# Altium project eBox_main.PrjPcb (part 2 of 2)

## Sheet eBox_ACdetect2.SchDoc: eBox_AC_Detect (2)
size A4; DocumentNumber: 7; SheetNumber: 7; SheetTotal: 9
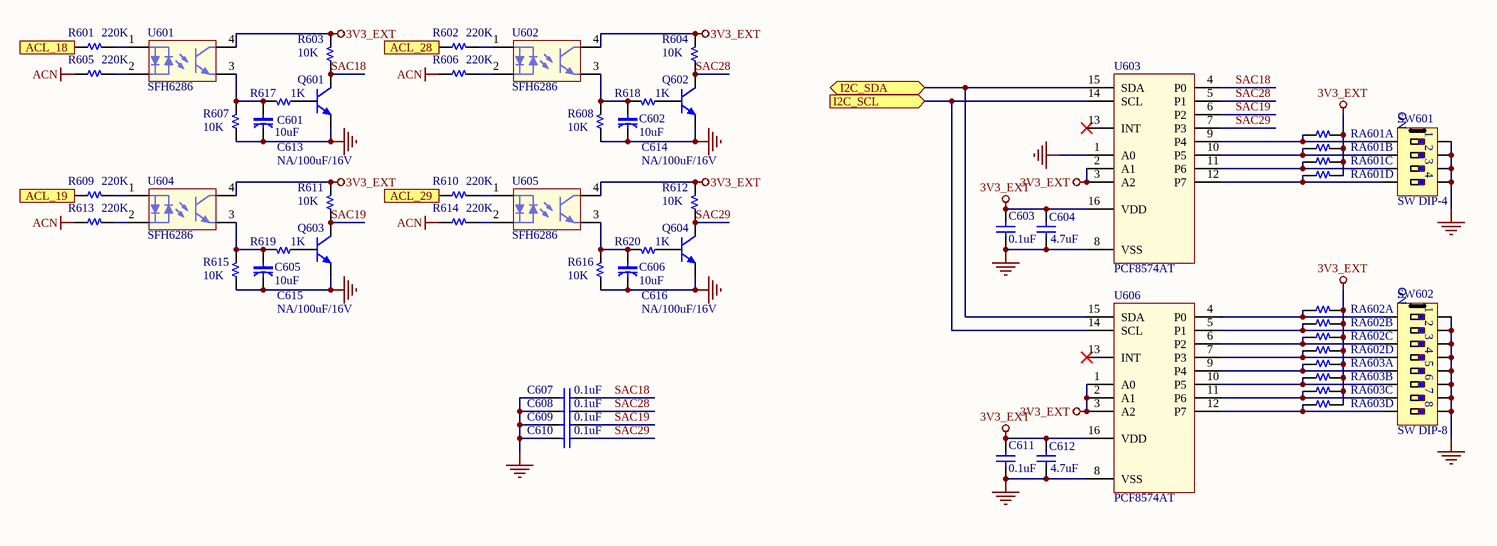
[diagram p6: eBox_ACdetect2.SchDoc]

### Parts
C601  10uF  [C 0805]
C602  10uF  [C 0805]
C603  0.1uF  [C 0603]
C604  4.7uF  [C 0603]
C605  10uF  [C 0805]
C606  10uF  [C 0805]
C607  0.1uF  [C 0805]
C608  0.1uF  [C 0805]
C609  0.1uF  [C 0805]
C610  0.1uF  [C 0805]
C611  0.1uF  [C 0603]
C612  4.7uF  [C 0603]
C613  NA/100uF/16V  [CYL/D.200/LS.75-D50H70P20]
C614  NA/100uF/16V  [CYL/D.200/LS.75-D50H70P20]
C615  NA/100uF/16V  [CYL/D.200/LS.75-D50H70P20]
C616  NA/100uF/16V  [CYL/D.200/LS.75-D50H70P20]
Q601  MMBT3904LT1G  [SOT-23]  (value not drawn)
Q602  MMBT3904LT1G  [SOT-23]  (value not drawn)
Q603  MMBT3904LT1G  [SOT-23]  (value not drawn)
Q604  MMBT3904LT1G  [SOT-23]  (value not drawn)
R601  220K  [R 0805]
R602  220K  [R 0805]
R603  10K  [R 0805]
R604  10K  [R 0805]
R605  220K  [R 0805]
R606  220K  [R 0805]
R607  10K  [R 0805]
R608  10K  [R 0805]
R609  220K  [R 0805]
R610  220K  [R 0805]
R611  10K  [R 0805]
R612  10K  [R 0805]
R613  220K  [R 0805]
R614  220K  [R 0805]
R615  10K  [R 0805]
R616  10K  [R 0805]
R617  1K  [R 0805]
R618  1K  [R 0805]
R619  1K  [R 0805]
R620  1K  [R 0805]
RA601  10K  [RAx4 1206 (3216)]  (value not drawn)  (parts A,B,C,D of 4)
RA602  10K  [RAx4 1206 (3216)]  (value not drawn)  (parts A,B,C,D of 4)
RA603  10K  [RAx4 1206 (3216)]  (value not drawn)  (parts A,B,C,D of 4)
SW601  SW DIP-4  [SW/DIP4]
SW602  SW DIP-8  [SW/DIP8/300]
U601  SFH6286  [SOP4 - SFH6286]
U602  SFH6286  [SOP4 - SFH6286]
U603  PCF8574AT  [SO16/PCF8574AT]
U604  SFH6286  [SOP4 - SFH6286]
U605  SFH6286  [SOP4 - SFH6286]
U606  PCF8574AT  [SO16/PCF8574AT]

### Ports
ACL_18 (in), ACL_19 (in), ACL_28 (in), ACL_29 (in), I2C_SCL (in), I2C_SDA (bidir)

### Nets
3V3_EXT: C603.1 C604.1 C611.1 C612.1 R603.2 R604.2 R611.2 R612.2 RA601.5 RA601.6 RA601.7 RA601.8 RA602.5 RA602.6 RA602.7 RA602.8 RA603.5 RA603.6 RA603.7 RA603.8 U601.4(C) U602.4(C) U603.2(A1) U603.3(A2) U603.16(VDD) U604.4(C) U605.4(C) U606.1(A0) U606.2(A1) U606.3(A2) U606.16(VDD)
ACN: R605.1 R606.1 R613.1 R614.1
GND: C601.2 C602.2 C603.2 C604.2 C605.2 C606.2 C607.1 C608.1 C609.1 C610.1 C611.2 C612.2 C613.2 C614.2 C615.2 C616.2 Q601.2(E) Q602.2(E) Q603.2(E) Q604.2(E) R607.1 R608.1 R615.1 R616.1 SW601.1 SW601.2 SW601.3 SW601.4 SW602.1 SW602.2 SW602.3 SW602.4 SW602.5 SW602.6 SW602.7 SW602.8 U603.1(A0) U603.8(VSS) U606.8(VSS)
ACL18: R601.1 ; port ACL_18
ACL19: R609.1 ; port ACL_19
ACL28: R602.1 ; port ACL_28
ACL29: R610.1 ; port ACL_29
I2C1_SCL: U603.14(SCL) U606.14(SCL) ; port I2C_SCL
I2C1_SDA: U603.15(SDA) U606.15(SDA) ; port I2C_SDA
SAC18: C607.2 Q601.3(C) R603.1 U603.4(P0)
SAC19: C609.2 Q603.3(C) R611.1 U603.6(P2)
SAC28: C608.2 Q602.3(C) R604.1 U603.5(P1)
SAC29: C610.2 Q604.3(C) R612.1 U603.7(P3)
NetC601_1: C601.1 C613.1 R607.2 R617.2 U601.3(E)
NetC602_1: C602.1 C614.1 R608.2 R618.2 U602.3(E)
NetC605_1: C605.1 C615.1 R615.2 R619.2 U604.3(E)
NetC606_1: C606.1 C616.1 R616.2 R620.2 U605.3(E)
NetQ601_1: Q601.1(B) R617.1
NetQ602_1: Q602.1(B) R618.1
NetQ603_1: Q603.1(B) R619.1
NetQ604_1: Q604.1(B) R620.1
NetR601_2: R601.2 U601.1(A/C)
NetR602_2: R602.2 U602.1(A/C)
NetR605_2: R605.2 U601.2(C/A)
NetR606_2: R606.2 U602.2(C/A)
NetR609_2: R609.2 U604.1(A/C)
NetR610_2: R610.2 U605.1(A/C)
NetR613_2: R613.2 U604.2(C/A)
NetR614_2: R614.2 U605.2(C/A)
NetRA601_1: RA601.1 SW601.8 U603.9(P4)
NetRA601_2: RA601.2 SW601.7 U603.10(P5)
NetRA601_3: RA601.3 SW601.6 U603.11(P6)
NetRA601_4: RA601.4 SW601.5 U603.12(P7)
NetRA602_1: RA602.1 SW602.16 U606.4(P0)
NetRA602_2: RA602.2 SW602.15 U606.5(P1)
NetRA602_3: RA602.3 SW602.14 U606.6(P2)
NetRA602_4: RA602.4 SW602.13 U606.7(P3)
NetRA603_1: RA603.1 SW602.12 U606.9(P4)
NetRA603_2: RA603.2 SW602.11 U606.10(P5)
NetRA603_3: RA603.3 SW602.10 U606.11(P6)
NetRA603_4: RA603.4 SW602.9 U606.12(P7)

Not connected (* = marked no-connect by the designer): U603 13(INT)*; U606 13(INT)*

### Notes on the sheet
- Title
- Size:
- Date:
- A4
- Number:
- Time:
- Revision:
- Sheet
- of
- NPN
- Lab
- File:
- (in symbol SW DIP-4) ON
- (in symbol SW DIP-8) ON

### Library data of the parts
C601 C602 C605-C610 = Capacitor NP: CAP CER 0.1UF 50V X7R 0805; TYPE: SMD; PACKAGE: SMD0805; STOCK CODE: CL21B104KBNC; SUPPLIER: tme.vn; STOCK DESC: 100nF/50V ±10% X7R SMD-0805 Capacitor
  C601 C602 C605 C606: UNIT PRICE: 500
  C607-C610: UNIT PRICE: 400
C603 C611 = Capacitor NP: CAP CER 0.1UF 50V X7R 0603; TYPE: SMD; PACKAGE: SMD0603; STOCK CODE: CC0603KRX7R9BB104; SUPPLIER: tme.vn; STOCK DESC: 100nF/50V ±10% X7R SMD-0603 Capacitor; UNIT PRICE: 400
C604 C612 = Capacitor NP: CAP CER 4.7UF 50V X7R 0603; TYPE: SMD; PACKAGE: SMD0603; STOCK CODE: CC0603KRX5R6BB475; SUPPLIER: tme.vn; STOCK DESC: 4.7uF 10V ±10% X5R SMD-0603 Capacitor; UNIT PRICE: 600
C613-C616 = Capacitor: CAP ALUM 100UF 20% 16V RADIAL; TYPE: NA; PACKAGE: 5x7 mm; STOCK CODE: 100uF/16V; SUPPLIER: tme.vn; STOCK DESC: 100uF/16V ±20% Aluminum Electrolytic Capacitor, 5x7 mm; UNIT PRICE: 800
Q601-Q604 = Transistor NPN: TRANS NPN 40V 0.2A SOT23; TYPE: SMD; STOCK CODE: LMBT3904LT1G; SUPPLIER: tme.vn; STOCK DESC: NPN General-Purpose Amplifier SMD Transistor; UNIT PRICE: 600
R601 R602 R605 R606 R609 R610 R613 R614 = Resistor: RES SMD 220K OHM 1% 1/8W 0805; PACKAGE: SMD0805; STOCK CODE: RM10JTN224; SUPPLIER: tme.vn; TYPE: SMD; STOCK DESC: 220K 5% SMD-0805 Resistor; UNIT PRICE: 60
R603 R604 R607 R608 R611 R612 R615 R616 = Resistor: RES SMD 10K OHM 1% 1/8W 0805; PACKAGE: SMD0805; STOCK CODE: RM10JTN103; SUPPLIER: tme.vn; TYPE: SMD; STOCK DESC: 10K ±5% SMD-0805 Resistor; UNIT PRICE: 60
R617-R620 = Resistor: RES SMD 1K OHM 5% 1/8W 0805; PACKAGE: SMD0805; STOCK CODE: RM10JTN102; SUPPLIER: tme.vn; TYPE: SMD; STOCK DESC: 1K 5% SMD-0805 Resistor; UNIT PRICE: 60
RA601-RA603 = Resistor Array x4: 10K 1/10W 5% Chip Resistor Array (SMD0603x4); PACKAGE: SMD1206; STOCK CODE: 4D03WAJ0103T5E; SUPPLIER: tme.vn; TYPE: SMD; STOCK DESC: 10K 1/10W 5% Chip Resistor Array (SMD0603x4); UNIT PRICE: 150
U603 U606 = PCF8574AT: Remote 8-bit I/O expander for I2C-bus with interrupt; PART NO: PCF8574AT/3; BRAND: NXP; PACKAGE: SO16; SUPPLIER: CHINA; TYPE: SMD; UNIT PRICE: 6160
SW601 = SW DIP-4: PACKAGE: DIP8; STOCK CODE: DIPSW04-R; SUPPLIER: tme.vn; TYPE: TH; STOCK DESC: DIP Swich 4 Slide type, RED; UNIT PRICE: 3500
SW602 = SW DIP-8: PACKAGE: DIP16; STOCK CODE: DIPSW08-R; SUPPLIER: tme.vn; TYPE: TH; STOCK DESC: DIP Swich 8 Slide type, RED; UNIT PRICE: 4500
U601 U602 U604 U605 = SFH6286: SUPPLIER: CHINA; TYPE: SMD; UNIT PRICE: 3600

## Sheet eBox_LCD.SchDoc: eBox_LCD
size A4; DocumentNumber: 8; SheetNumber: 8; SheetTotal: 9
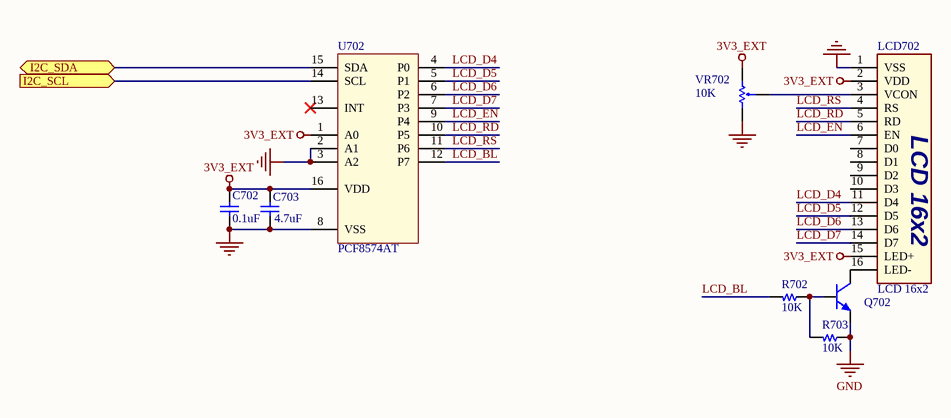
[diagram p7: eBox_LCD.SchDoc]

### Parts
C702  0.1uF  [C 0603]
C703  4.7uF  [C 0603]
LCD702  LCD 16x2  [LCD 1602A]
Q702  MMBT3904LT1G  [SOT-23]  (value not drawn)
R702  10K  [R 0603]
R703  10K  [R 0603]
U702  PCF8574AT  [SO16/PCF8574AT]
VR702  10K  [R VAR A 3D]

### Ports
I2C_SCL (in), I2C_SDA (bidir)

### Nets
3V3_EXT: C702.1 C703.1 LCD702.2(VDD) LCD702.15(LED+) U702.1(A0) U702.16(VDD) VR702.1
GND: C702.2 C703.2 LCD702.1(VSS) Q702.2(E) R703.1 U702.2(A1) U702.3(A2) U702.8(VSS) VR702.3
I2C1_SCL: U702.14(SCL) ; port I2C_SCL
I2C1_SDA: U702.15(SDA) ; port I2C_SDA
LCD_BL: R702.2 U702.12(P7)
LCD_D4: LCD702.11(D4) U702.4(P0)
LCD_D5: LCD702.12(D5) U702.5(P1)
LCD_D6: LCD702.13(D6) U702.6(P2)
LCD_D7: LCD702.14(D7) U702.7(P3)
LCD_EN: LCD702.6(EN) U702.9(P4)
LCD_RD: LCD702.5(RD) U702.10(P5)
LCD_RS: LCD702.4(RS) U702.11(P6)
NetLCD702_3: LCD702.3(VCON) VR702.2
NetLCD702_16: LCD702.16(LED-) Q702.3(C)
NetQ702_1: Q702.1(B) R702.1 R703.2

Not connected (* = marked no-connect by the designer): LCD702 7(D0) 8(D1) 9(D2) 10(D3); U702 13(INT)*

### Notes on the sheet
- Title
- Size:
- Date:
- A4
- Number:
- Time:
- Revision:
- Sheet
- of
- NPN
- Lab
- File:

### Library data of the parts
C702 = Capacitor NP: CAP CER 0.1UF 50V X7R 0603; TYPE: SMD; PACKAGE: SMD0603; STOCK CODE: CC0603KRX7R9BB104; SUPPLIER: tme.vn; STOCK DESC: 100nF/50V ±10% X7R SMD-0603 Capacitor; UNIT PRICE: 400
C703 = Capacitor NP: CAP CER 4.7UF 50V X7R 0603; TYPE: SMD; PACKAGE: SMD0603; STOCK CODE: CC0603KRX5R6BB475; SUPPLIER: tme.vn; STOCK DESC: 4.7uF 10V ±10% X5R SMD-0603 Capacitor; UNIT PRICE: 600
LCD702 = LCD 16x2: Character LCD 16x2; TYPE: TH
Q702 = Transistor NPN: TRANS NPN 40V 0.2A SOT23; TYPE: SMD; STOCK CODE: LMBT3904LT1G; SUPPLIER: tme.vn; STOCK DESC: NPN General-Purpose Amplifier SMD Transistor; UNIT PRICE: 600
R702 R703 = Resistor: RES SMD 10K OHM 1% 1/10W 0603; PACKAGE: SMD0603; STOCK CODE: 0603F1000T5E; SUPPLIER: tme.vn; TYPE: SMD; STOCK DESC: 10K ±1% SMD-0603 Resistor; UNIT PRICE: 60
U702 = PCF8574AT: as U603 on sheet eBox_ACdetect2; PACKAGE: SO16; SUPPLIER: CHINA; TYPE: SMD; UNIT PRICE: 6160
VR702 = Resistor Variable: TRIMMER 10K OHM 0.5W PC PIN; PACKAGE: DIP3; STOCK CODE: 3362P-1-103LF; SUPPLIER: tme.vn; TYPE: TH; STOCK DESC: TRIMMER 10K OHM 0.5W PC PIN; UNIT PRICE: 7000

## Sheet eBox_Wifi.SchDoc: eBox_3G
size A4; DocumentNumber: 9; SheetNumber: 9; SheetTotal: 9
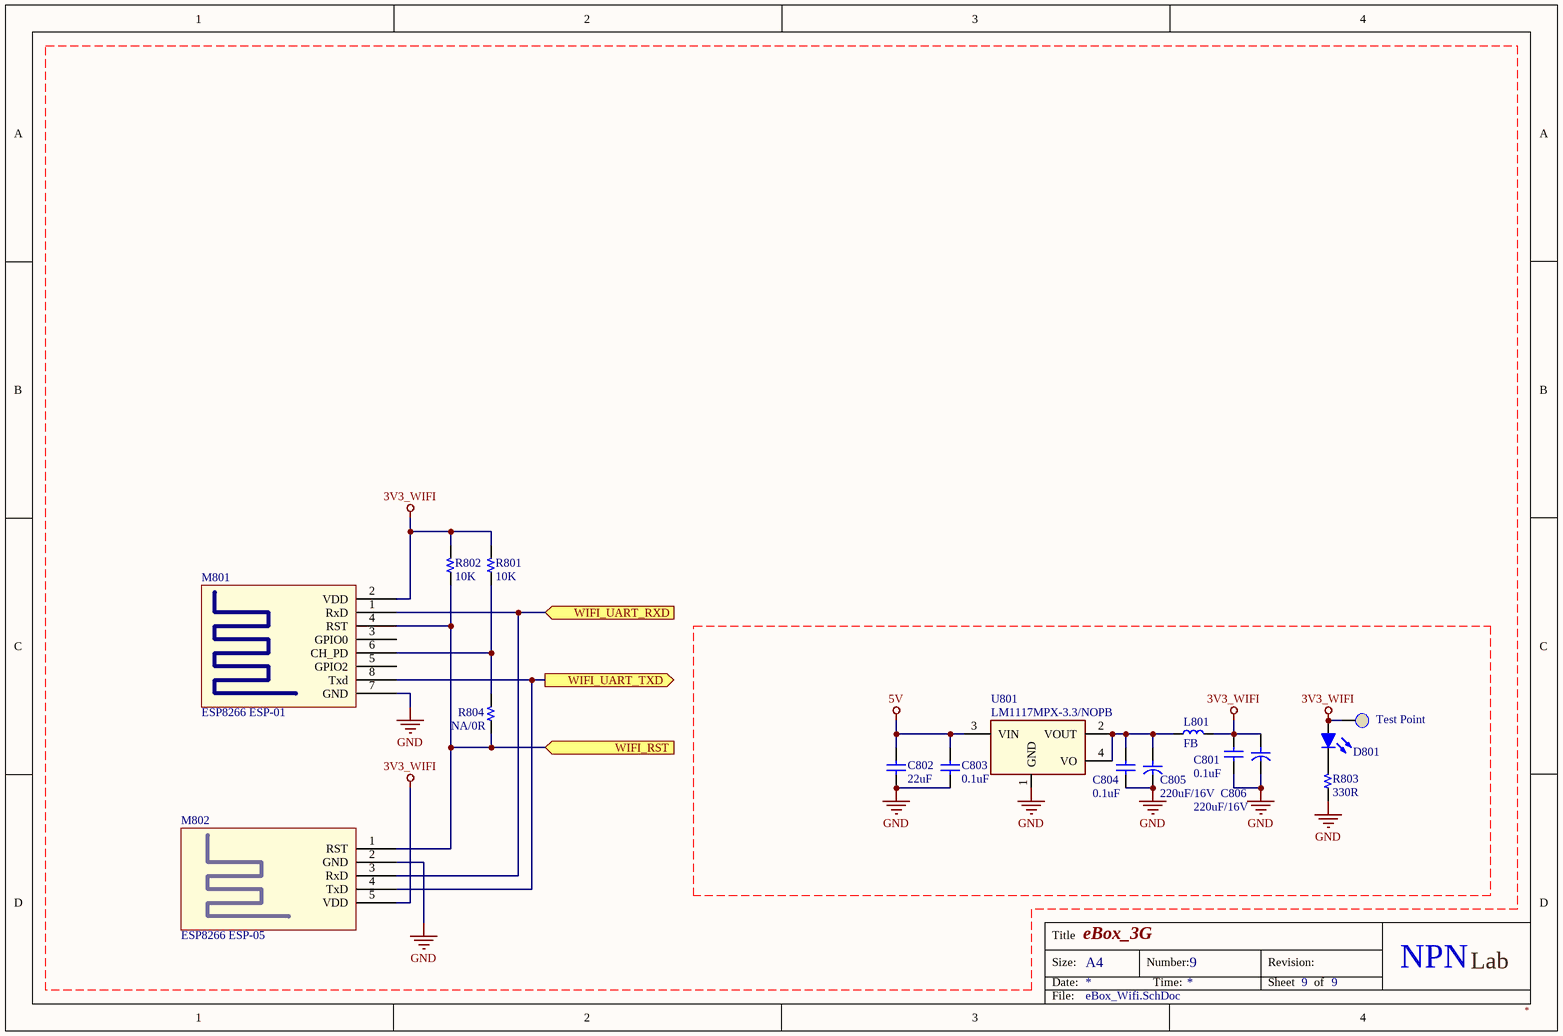
[diagram p8: eBox_Wifi.SchDoc]

### Parts
3V3WiFi  Test Point  [TestPoint/SMD/1.5mm]  (no BOM)
C801  0.1uF  [C 0805]
C802  22uF  [C 1210 mix 0805]
C803  0.1uF  [C 0805]
C804  0.1uF  [C 0805]
C805  220uF/16V  [CYL/D.250/LS.100-D63H70P25]
C806  220uF/16V  [CYL/D.250/LS.100-D63H70P25]
D801  LED RED 3MM  [LED 3MM - red]  (value not drawn)
L801  FB  [L 0805 (2012)]
M801  ESP8266 ESP-01  [ESP8266 ESP-01]
M802  ESP8266 ESP-05  [ESP8266 ESP-05]
R801  10K  [R 0603]
R802  10K  [R 0603]
R803  330R  [R 0603]
R804  NA/0R  [R 0603]
U801  LM1117MPX-3.3/NOPB  [SOT-223]

### Ports
WIFI_RST (in), WIFI_UART_RXD (in), WIFI_UART_TXD (out)

### Nets
3V3_WIFI: 3V3WiFi.1(TP) C801.1 C806.1 D801.1(A) L801.2 M801.2(VDD) M802.5(VDD) R801.2 R802.2
5V: C802.1 C803.1 U801.3(VIN)
GND: C801.2 C802.2 C803.2 C804.2 C805.2 C806.2 M801.7(GND) M802.2(GND) R803.1 U801.1(GND)
UART4_RX: M801.8(Txd) M802.4(TxD) ; port WIFI_UART_TXD
UART4_TX: M801.1(RxD) M802.3(RxD) ; port WIFI_UART_RXD
NetC804_1: C804.1 C805.1 L801.1 U801.2(VOUT) U801.4(VO)
NetD801_2: D801.2(K) R803.2
NetM801_4: M801.4(RST) M802.1(RST) R802.1 R804.1 ; port WIFI_RST
NetM801_6: M801.6(CH_PD) R801.1 R804.2

Not connected (* = marked no-connect by the designer): M801 3(GPIO0) 5(GPIO2)

### Notes on the sheet
- Title
- Size:
- Date:
- A4
- Number:
- Time:
- Revision:
- Sheet
- of
- NPN
- Lab
- File:

### Library data of the parts
C801 C803 C804 = Capacitor NP: CAP CER 0.1UF 50V X7R 0805; TYPE: SMD; PACKAGE: SMD0805; STOCK CODE: CL21B104KBNC; SUPPLIER: tme.vn; STOCK DESC: 100nF/50V ±10% X7R SMD-0805 Capacitor; UNIT PRICE: 400
C802 = Capacitor NP: CAP CER 22UF 10% 16V X7R 1210; TYPE: SMD; PACKAGE: SMD1210; STOCK CODE: CC1210KKX7R7BB226; SUPPLIER: tme.vn; STOCK DESC: 22uF/16V ±10% X7R SMD-1210 Capacitor; UNIT PRICE: 2500
C805 C806 = Capacitor: CAP ALUM 220UF 20% 16V RADIAL; TYPE: TH; PACKAGE: 6.3x12; STOCK CODE: 220uF/16V; SUPPLIER: tme.vn; STOCK DESC: 220uF/16V ±20% Aluminum Electrolytic Capacitor, Size 6.3x12mm; UNIT PRICE: 900
D801 = Led: LED RED DIFFUSED 3MM ROUND T/H; TYPE: TH; PACKAGE: 3MM; STOCK CODE: HT204SURD; SUPPLIER: tme.vn; STOCK DESC: 3mm Base LED; UNIT PRICE: 300
L801 = Inductor: Chip Ferrite Bead; TYPE: SMD; PACKAGE: SMD0805; STOCK CODE: CB2012D300ST(F); SUPPLIER: tme.vn; STOCK DESC: 30 Ohm SMD-0805 Chip Ferrite Bead; UNIT PRICE: 500
R801 R802 = Resistor: RES SMD 10K OHM 1% 1/10W 0603; PACKAGE: SMD0603; STOCK CODE: 0603F1000T5E; SUPPLIER: tme.vn; TYPE: SMD; STOCK DESC: 10K ±1% SMD-0603 Resistor; UNIT PRICE: 60
R803 = Resistor: RES SMD 330 OHM 1% 1/10W 0603; PACKAGE: SMD0603; STOCK CODE: RM06JTN331; SUPPLIER: tme.vn; TYPE: SMD; STOCK DESC: 330R ±5% SMD-0603 Resistor; UNIT PRICE: 50
R804 = Resistor: RES SMD 0 OHM 1% 1/10W 0603; PACKAGE: SMD0603; TYPE: SMD
U801 = AMS1117: IC REG LINEAR 3.3V 800MA SOT223; BRAND: AMS; PACKAGE: SOT-223; STOCK CODE: AMS1117-3.3; SUPPLIER: tme.vn; TYPE: SMD; STOCK DESC: 3.3V 1A Low-dropout Linear Regulator; UNIT PRICE: 4000
3V3WiFi = Test Point: TYPE: NO-BOM; UNIT PRICE: 0
M801 = ESP8266 ESP-01: TYPE: NA
M802 = ESP8266 ESP-05: TYPE: NA

## Nets that join several sheets
1V8: eBox_MCU (R201.1), eBox_Peripherals (10 pins), eBox_Power (1V8.1 C111.1 C112.1 L102.2)
3V3_EXT: eBox_MCU (15 pins), eBox_Peripherals (R301.2), eBox_Power (5 pins), eBox_ACdetect (46 pins), eBox_ACdetect2 (31 pins), eBox_LCD (7 pins)
5V: eBox_MCU (5 pins), eBox_Peripherals (R302.2), eBox_Power (15 pins), eBox_Wifi (C802.1 C803.1 U801.3)
12V: eBox_Peripherals (12 pins), eBox_3G (M401.1 M401.2), eBox_Power (9 pins)
ACL: eBox_Peripherals (5 pins), eBox_Power (9 pins), eBox_ACdetect (R557.1)
ACN: eBox_Peripherals (11 pins), eBox_Power (9 pins), eBox_ACdetect (17 pins), eBox_ACdetect2 (R605.1 R606.1 R613.1 R614.1)
GND: eBox_MCU (23 pins), eBox_Peripherals (12 pins), eBox_3G (M401.9 M401.10), eBox_Power (46 pins), eBox_ACdetect (101 pins), eBox_ACdetect2 (39 pins), eBox_LCD (9 pins), eBox_Wifi (10 pins)
GND18: eBox_Peripherals (10 pins), eBox_Power (C111.2 C112.2 L106.2)
GNDEARTH: eBox_Notes (H6.1), eBox_Power (C106.2 C107.2)
VCC: eBox_MCU (D203.2 L202.1), eBox_Power (5 pins)
ACL10: eBox_Peripherals (M301.11), eBox_ACdetect (R501.1)
ACL11: eBox_Peripherals (M301.14), eBox_ACdetect (R517.1)
ACL12: eBox_Peripherals (M304.11), eBox_ACdetect (R533.1)
ACL13: eBox_Peripherals (M304.14), eBox_ACdetect (R541.1)
ACL14: eBox_Peripherals (M305.11), eBox_ACdetect (R549.1)
ACL15: eBox_Peripherals (M305.14), eBox_ACdetect (R560.1)
ACL16: eBox_Peripherals (M303.11), eBox_ACdetect (R503.1)
ACL17: eBox_Peripherals (M303.14), eBox_ACdetect (R519.1)
ACL18: eBox_Peripherals (M302.11), eBox_ACdetect2 (R601.1)
ACL19: eBox_Peripherals (M302.14), eBox_ACdetect2 (R609.1)
ACL20: eBox_Peripherals (M301.13), eBox_ACdetect (R502.1)
ACL21: eBox_Peripherals (M301.12), eBox_ACdetect (R518.1)
ACL22: eBox_Peripherals (M304.13), eBox_ACdetect (R534.1)
ACL23: eBox_Peripherals (M304.12), eBox_ACdetect (R542.1)
ACL24: eBox_Peripherals (M305.13), eBox_ACdetect (R550.1)
ACL25: eBox_Peripherals (M305.12), eBox_ACdetect (R561.1)
ACL26: eBox_Peripherals (M303.13), eBox_ACdetect (R504.1)
ACL27: eBox_Peripherals (M303.12), eBox_ACdetect (R520.1)
ACL28: eBox_Peripherals (M302.13), eBox_ACdetect2 (R602.1)
ACL29: eBox_Peripherals (M302.12), eBox_ACdetect2 (R610.1)
I2C1_SCL: eBox_MCU (R210.2 R212.1 U203.4), eBox_ACdetect (U511.14 U514.14), eBox_ACdetect2 (U603.14 U606.14), eBox_LCD (U702.14)
I2C1_SDA: eBox_MCU (R211.2 R213.1 U203.6), eBox_ACdetect (U511.15 U514.15), eBox_ACdetect2 (U603.15 U606.15), eBox_LCD (U702.15)
NetC538_2: eBox_MCU (U201.38), eBox_ACdetect (C538.2 Q515.3 R558.1)
NetM801_4: eBox_MCU (U201.41), eBox_Wifi (M801.4 M802.1 R802.1 R804.1)
NetR103_1: eBox_MCU (U201.8), eBox_Power (R103.1 R105.2)
NetU201_14: eBox_MCU (U201.14), eBox_Peripherals (U301.1 U301.2)
NetU201_15: eBox_MCU (U201.15), eBox_Peripherals (U301.6 U301.7)
NetU201_16: eBox_MCU (U201.16), eBox_Peripherals (U302.1 U302.2)
NetU201_17: eBox_MCU (U201.17), eBox_Peripherals (U302.6 U302.7)
NetU201_20: eBox_MCU (U201.20), eBox_Peripherals (U303.1 U303.2)
NetU201_21: eBox_MCU (U201.21), eBox_Peripherals (U303.6 U303.7)
NetU201_22: eBox_MCU (U201.22), eBox_Peripherals (U304.1 U304.2)
NetU201_23: eBox_MCU (U201.23), eBox_Peripherals (U304.6 U304.7)
NetU201_26: eBox_MCU (U201.26), eBox_Peripherals (U307.1 U307.2)
NetU201_27: eBox_MCU (U201.27), eBox_Peripherals (U307.6 U307.7)
NetU202_12: eBox_MCU (U202.12), eBox_Peripherals (U305.7)
NetU202_13: eBox_MCU (U202.13), eBox_Peripherals (U305.6)
NetU202_14: eBox_MCU (U202.14), eBox_Peripherals (U305.5)
NetU202_15: eBox_MCU (U202.15), eBox_Peripherals (U305.4)
NetU202_16: eBox_MCU (U202.16), eBox_Peripherals (U305.3)
NetU202_17: eBox_MCU (U202.17), eBox_Peripherals (U305.2)
NetU202_18: eBox_MCU (U202.18), eBox_Peripherals (U305.1)
NetU204_16: eBox_MCU (U204.16), eBox_Peripherals (U306.3)
NetU204_17: eBox_MCU (U204.17), eBox_Peripherals (U306.2)
NetU204_18: eBox_MCU (U204.18), eBox_Peripherals (U306.1)
PERST: eBox_MCU (U201.40), eBox_3G (M401.4)
PWRON: eBox_MCU (U201.39), eBox_3G (M401.3)
UART4_RX: eBox_MCU (U201.52), eBox_Wifi (M801.8 M802.4)
UART4_TX: eBox_MCU (U201.51), eBox_Wifi (M801.1 M802.3)
UART_RXD: eBox_MCU (U201.43), eBox_3G (M401.6)
UART_TXD: eBox_MCU (U201.42), eBox_3G (M401.8)